# Altium project PCB_EStop.PrjPCB
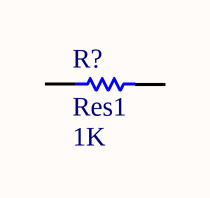
[diagram p0: PCBestop.SchDoc]
1 sheet, 1 parts. Net scope: global (net labels, ports and power ports of the same name join across sheets).

## Sheet PCBestop.SchDoc
size A4

### Parts
R?  Res1  value 1K  [AXIAL-0.3]

### Nets

Not connected (* = marked no-connect by the designer): R? 1 2

### Library data of the parts
R? = Res1: Resistor; Published: 8-Jun-2000; LatestRevisionDate: 17-Jul-2002; LatestRevisionNote: Re-released for DXP Platform.; PackageReference: AXIAL-0.3; Publisher: Altium Limited; PackageDescription: Axial Device, Thru-Hole; 2 Leads; 0.3 in Pin Spacing